# Altium schematic sheet DB10005_Wireless.SchDoc
size A4
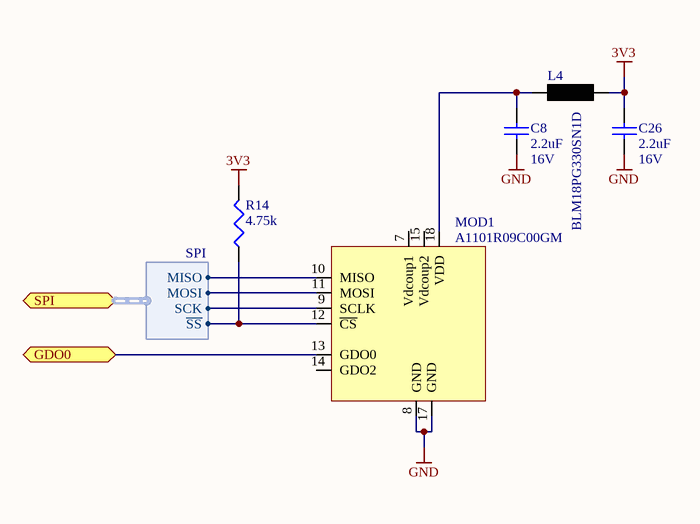
[diagram p0: DB10005_Wireless.SchDoc]

## Parts
C8  2.2uF  Voltage Rating: 16V  [C0603]
C26  2.2uF  Voltage Rating: 16V  [C0603]
L4  BLM18PG330SN1D  [L0603]
MOD1  A1101R09C00GM  [AxxLR09_Short]
R14  4.75k  [0402]

## Ports
GDO0, SPI (harness SPI)

## Harnesses
SPI: ~{SS}, SCK, MISO, MOSI

## Nets
3V3: C26.2 L4.2 R14.2
GND: C8.1 C26.1 MOD1.8(GND) MOD1.17(GND)
GDO0: MOD1.13(GDO0) ; port GDO0
NetC8_2: C8.2 L4.1 MOD1.18(VDD)
NetMOD1_9: MOD1.9(SCLK) ; port SPI.SCK
NetMOD1_10: MOD1.10(MISO) ; port SPI.MISO
NetMOD1_11: MOD1.11(MOSI) ; port SPI.MOSI
NetMOD1_12: MOD1.12(~{CS}) R14.1 ; port SPI.~{SS}

Not connected (* = marked no-connect by the designer): MOD1 7(Vdcoup1) 14(GDO2) 15(Vdcoup2)

## Library data of the parts
C8 C26 = 2.2uF/0603/CER/16V: Capacitor, 2.2uF, 16V, X5R; Capacitance Tolerance: +/- 10%; Capacitor Case Style: 0603; Brand Number: GRM188R61C225KE15D; Brand: MURATA; Dielectric Characteristic: X5R; Capacitance: 2.2uF; Temperature Range: -55°C to 85°C; Price: 0,077; Order Code Supplier: 1735526; Supplier: Farnell
L4 = BLM18PG330SN1D: Ferrite Bead, Impedance:33ohm, DC Resistance Max:0.025ohm, DC Current Rating:3A; Brand: MURATA; Case Style: 0603; Brand Number: BLM18PG330SN1D; Price: 0,048; Supplier: Farnell; Order Code Supplier: 1515742
MOD1 = A1101R09C00GM: SubRF tranceiver module; Brand: Anaren; Order Code Supplier: 2096118; Brand Number: A1101R09C00GM; Supplier: Farnell; Price: 12,47
R14 = 4.75k/0402/0063W/50V: Resistor, 4.75k, 0.1%, 0.0625W, 50V, 100PPM, 0402; Brand: VISHAY DRALORIC; Brand Number: CRCW04024K75FKED; Power Rating: 0.063W; Case Style: 0402; Order Code Supplier: 2121689; Price: 0,0006; Resistance: 4.75k; Supplier: Farnell; Temperature Coefficient: ± 100PPM; Temperature Range: -55°C to +125°C; Voltage Rating: 50V